# EAGLE design Sensor_board_2024 (EAGLE 9.6.2)
CHECKED: 02/25/2025; COMPANY: CDOSR; DATE: 02/25/2024; DESIGNER: CDOSR; DRAWN: 02/25/2024; DRGNO: 1; REV: 01; VERSION: v10; YEAR: 2024
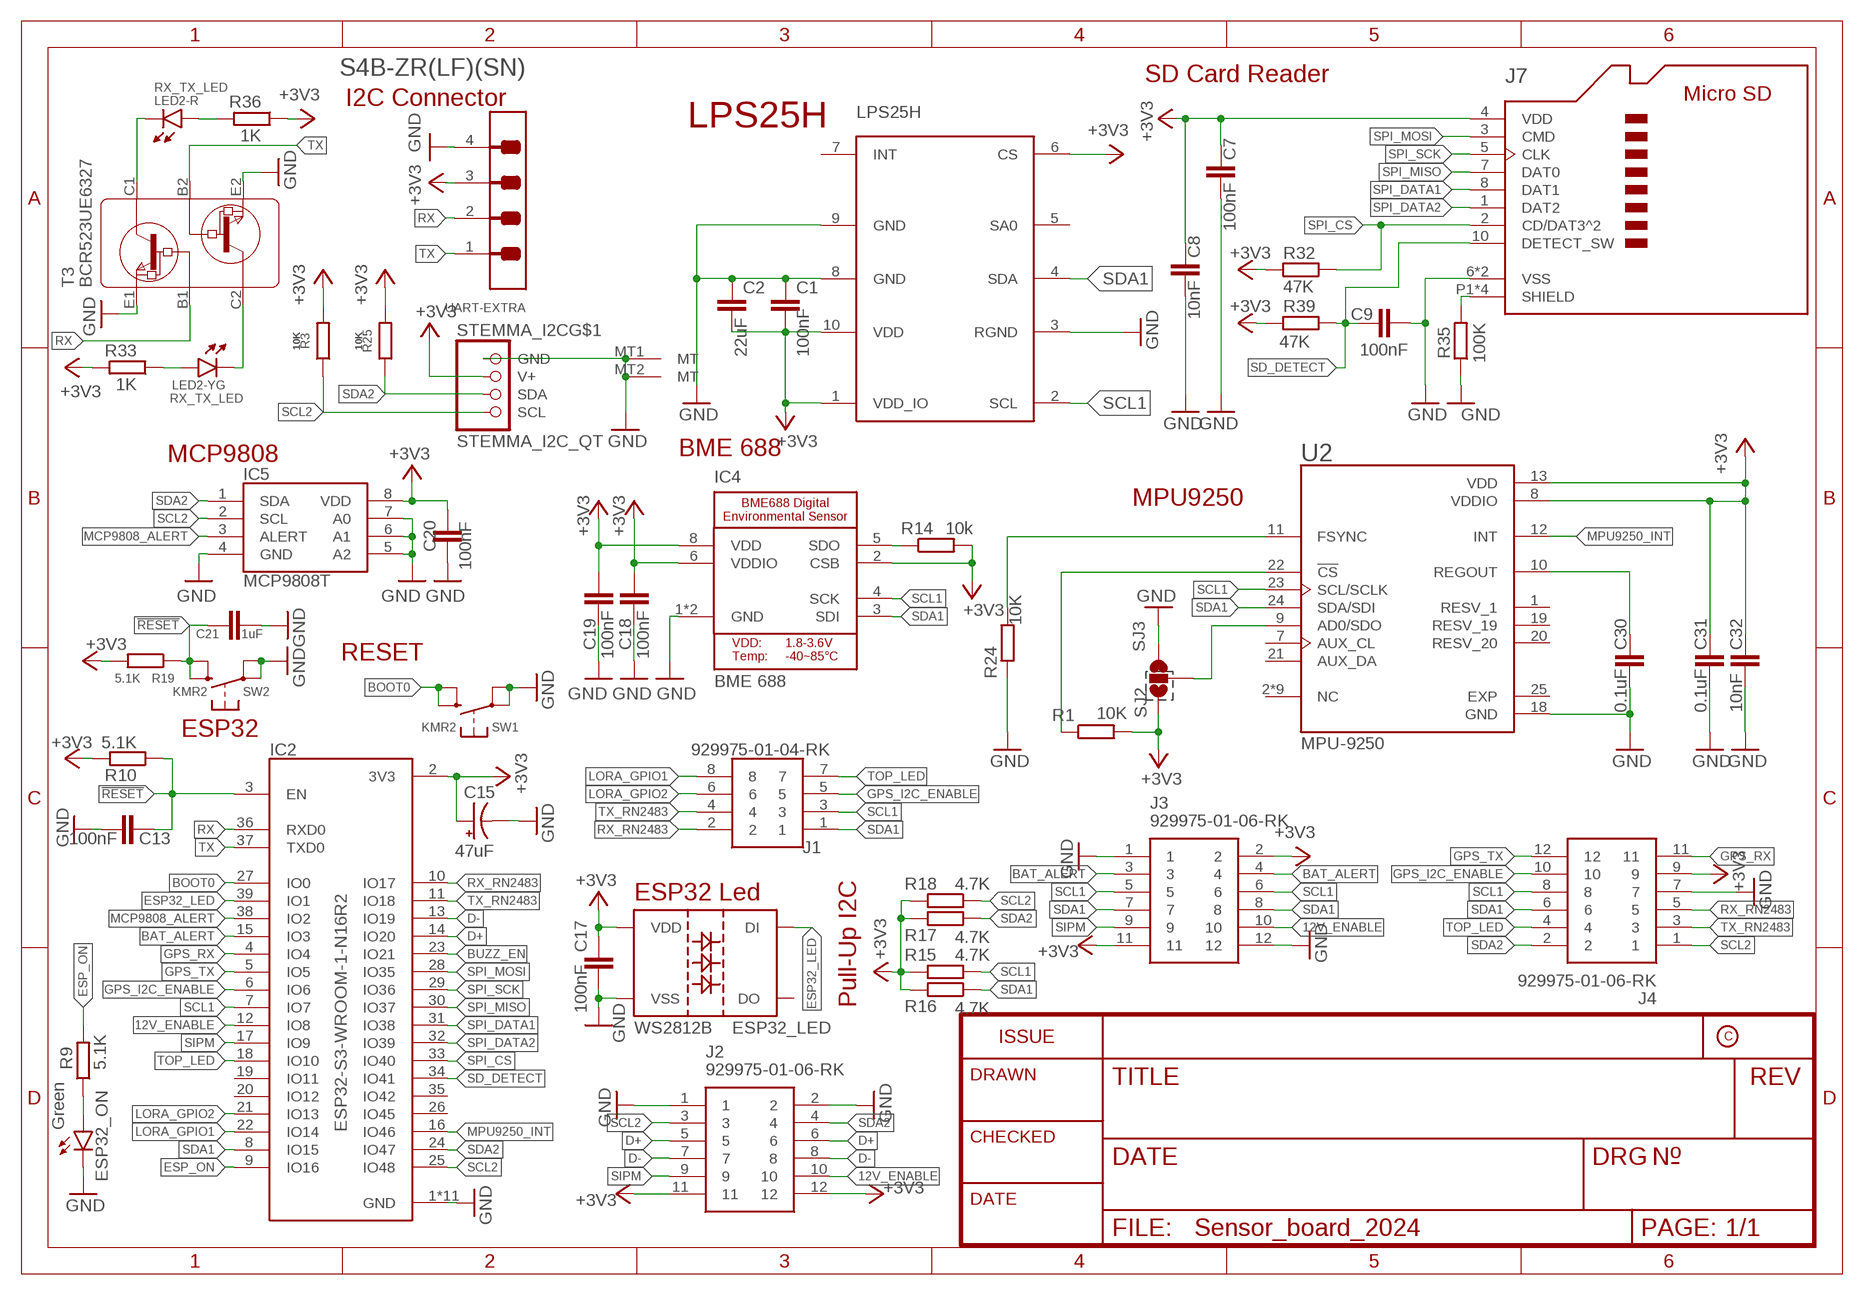
[diagram p0: schematic, sheet 1]

## Parts
C1  100nF  C-EUC0603  [C0603]
C2  22uF  C-EUC0603  [C0603]
C7  100nF  C-EUC0603  [C0603]
C8  10nF  C-EUC0603  [C0603]
C9  100nF  C-EUC0603  [C0603]
C13  100nF  C-EUC0603  [C0603]
C15  47uF  293D226X9025C2TE3  [CAPMP6032X250N]
C17  100nF  C-EUC0603  [C0603]
C18  100nF  C-EUC0603  [C0603]
C19  100nF  C-EUC0603  [C0603]
C20  100nF  C-EUC0603  [C0603]
C21  1uF  C-EUC0603  [C0603]
C30  0.1uF  0.1UF-25V(+80/-20%)(0603)  [0603-CAP]
C31  0.1uF  0.1UF-25V(+80/-20%)(0603)  [0603-CAP]
C32  10nF  0.1UF-25V(+80/-20%)(0603)  [0603-CAP]
ESP32_LED  WS2812B  [WS2812B]
ESP32_ON  Green  LEDCHIPLED_0805  [CHIPLED_0805]
IC2  ESP32-S3-WROOM-1-N16R2  [XCVR_ESP32-S3-WROOM-1-N16R2]
IC4  BME 688  BME_688_V1  [BME_688]
IC5  MCP9808T  MCP9808T-E_MS  [SOP65P490X110-8N]
J1  929975-01-04-RK  [RHDR8W76P254_2X4_1016X508X839P]
J2  929975-01-06-RK  [RHDR12W76P254_2X6_1524X508X839]
J3  929975-01-06-RK  [RHDR12W76P254_2X6_1524X508X839]
J4  929975-01-06-RK  [RHDR12W76P254_2X6_1524X508X839]
J7  503398-1892  [MOLEX_503398-1892]
LED2  RX_TX_LED  OSRG1206C1C  [3216(1206)-4]
LPS25H  LPS25H  [LPS25H]
R1  10K  R-EU_R0603  [R0603]
R3  10K  R-EU_R0603  [R0603]
R9  5.1K  R-EU_R0603  [R0603]
R10  5.1K  R-EU_R0603  [R0603]
R14  10k  R-EU_R0603  [R0603]
R15  4.7K  R-EU_R0603  [R0603]
R16  4.7K  R-EU_R0603  [R0603]
R17  4.7K  R-EU_R0603  [R0603]
R18  4.7K  R-EU_R0603  [R0603]
R19  5.1K  R-EU_R0603  [R0603]
R24  10K  R-EU_R0603  [R0603]
R25  10K  R-EU_R0603  [R0603]
R32  47K  R-EU_R0603  [R0603]
R33  1K  R-EU_R0603  [R0603]
R35  100K  R-EU_R0603  [R0603]
R36  1K  R-EU_R0603  [R0603]
R39  47K  R-EU_R0603  [R0603]
SJ2  SJ3  SPARKFUN_SOLDERJUMPER_2WAYS  [SPARKFUN_SJ_3]
STEMMA_I2C  STEMMA_I2C_QT  [JST_SH4]
SW1  KMR2  SWITCH_TACT_SMT4.6X2.8  [BTN_KMR2_4.6X2.8]
SW2  KMR2  SWITCH_TACT_SMT4.6X2.8  [BTN_KMR2_4.6X2.8]
T3  BCR523UE6327  NPNSOT23  [SOT-23]
U2  MPU-9250  [QFN40P300X300X105-25N]
UART-EXTRA  JST_S4B-ZR_LF  JST_S4B-ZR_LF_SNJST_S4B-ZR_LF_SN_0_0  [JST_S4B-ZR_LF_SN_0]

## Nets
12V_ENABLE: IC2.12(IO8) J2.10 J3.10
!RESET: C13.1 C21.1 IC2.3(EN) R10.1 R19.1 SW2.B'(S1) SW2.B(S)
+3V3: C1.2 C2.2 C7.1 C8.1 C15.1(+) C17.1 C18.2 C19.2 C20.2 C31.1 C32.1 ESP32_LED.1(VDD) IC2.2(3V3) IC4.2(CSB) IC4.6(VDDIO) IC4.8(VDD) IC5.8(VDD) J2.11 J2.12 J3.2 J3.11 J4.9 J7.4(VDD) LPS25H.1(VDD_IO) LPS25H.6(CS) LPS25H.10(VDD) R1.2 R3.2 R10.2 R14.2 R15.2 R16.2 R17.2 R18.2 R19.2 R25.2 R32.2 R33.2 R36.1 R39.2 SJ2.1 STEMMA_I2C.2(V+) U2.8(VDDIO) U2.13(VDD) UART-EXTRA.3
BAT_ALERT: IC2.15(IO3) J3.3 J3.4
BOOT0: IC2.27(IO0) SW1.B'(S1) SW1.B(S)
BUZZ_EN: IC2.23(IO21)
D+: IC2.14(IO20) J2.5 J2.6
D-: IC2.13(IO19) J2.7 J2.8
ESP32_LED: ESP32_LED.4(DI) IC2.39(IO1)
ESP_ON: IC2.9(IO16) R9.2
GND: C1.1 C2.1 C7.2 C8.2 C9.2 C13.2 C15.2(-) C17.2 C18.1 C19.1 C20.1 C21.2 C30.2 C31.2 C32.2 ESP32_LED.3(VSS) ESP32_ON.C IC2.1(GND) IC2.40(GND) IC2.41_1(GND) IC2.41_2(GND) IC2.41_3(GND) IC2.41_4(GND) IC2.41_5(GND) IC2.41_6(GND) IC2.41_7(GND) IC2.41_8(GND) IC2.41_9(GND) IC4.1(GND) IC4.7(GND) IC5.4(GND) IC5.5(A2) IC5.6(A1) IC5.7(A0) J2.1 J2.2 J3.1 J3.12 J4.7 J7.6(VSS) J7.9(VSS) LPS25H.3(RGND) LPS25H.8(GND) LPS25H.9(GND) R24.1 R35.1 SJ2.3 STEMMA_I2C.1(GND) STEMMA_I2C.MT1(MT) STEMMA_I2C.MT2(MT) SW1.A'(P1) SW1.A(P) SW2.A'(P1) SW2.A(P) T3.E1 T3.E2 U2.18(GND) UART-EXTRA.4
GPS_I2C_ENABLE: IC2.6(IO6) J1.5 J4.10
GPS_RX: IC2.4(IO4) J4.11
GPS_TX: IC2.5(IO5) J4.12
LORA_GPIO1: IC2.22(IO14) J1.8
LORA_GPIO2: IC2.21(IO13) J1.6
MCP9808_ALERT: IC2.38(IO2) IC5.3(ALERT)
MICROSD_SH2: J7.P1(SHIELD) J7.P2(SHIELD) J7.P3(SHIELD) J7.P4(SHIELD) R35.2
MPU9250_INT: IC2.16(IO46) U2.12(INT)
N$2: IC4.5(SDO) R14.1
N$3: R1.1 U2.22(!CS)
N$4: R24.2 U2.11(FSYNC)
N$6: ESP32_ON.A R9.1
N$7: SJ2.2 U2.9(AD0/SDO)
N$17: LED2.3(-YG:C) T3.C2
N$18: LED2.1(-R:C) T3.C1
N$22: LED2.2(-R:A) R36.2
N$23: LED2.4(-YG:A) R33.1
REGOUT: C30.1 U2.10(REGOUT)
RX: IC2.36(RXD0) T3.B1 UART-EXTRA.2
RX_RN2483: IC2.10(IO17) J1.2 J4.5
SCL1: IC2.7(IO7) IC4.4(SCK) J1.3 J3.5 J3.6 J4.8 LPS25H.2(SCL) R15.1 U2.23(SCL/SCLK)
SCL2: IC2.25(IO48) IC5.2(SCL) J2.3 J4.1 R3.1 R18.1 STEMMA_I2C.4(SCL)
SD_DETECT: C9.1 IC2.34(IO41) J7.10(DETECT_SW) R39.1
SDA1: IC2.8(IO15) IC4.3(SDI) J1.1 J3.7 J3.8 J4.6 LPS25H.4(SDA) R16.1 U2.24(SDA/SDI)
SDA2: IC2.24(IO47) IC5.1(SDA) J2.4 J4.2 R17.1 R25.1 STEMMA_I2C.3(SDA)
SIPM: IC2.17(IO9) J2.9 J3.9
SPI_CS: IC2.33(IO40) J7.2(CD/DAT3^2) R32.1
SPI_DATA1: IC2.31(IO38) J7.8(DAT1)
SPI_DATA2: IC2.32(IO39) J7.1(DAT2)
SPI_MISO: IC2.30(IO37) J7.7(DAT0)
SPI_MOSI: IC2.28(IO35) J7.3(CMD)
SPI_SCK: IC2.29(IO36) J7.5(CLK)
TOP_LED: IC2.18(IO10) J1.7 J4.4
TX: IC2.37(TXD0) T3.B2 UART-EXTRA.1
TX_RN2483: IC2.11(IO18) J1.4 J4.3
Unconnected: ESP32_LED.2(DO) IC2.19(IO11) IC2.20(IO12) IC2.26(IO45) IC2.35(IO42) LPS25H.5(SA0) LPS25H.7(INT) U2.2(NC) U2.3(NC) U2.4(NC) U2.5(NC) U2.6(NC) U2.7(AUX_CL) U2.14(NC) U2.15(NC) U2.16(NC) U2.17(NC) U2.19(RESV_19) U2.21(AUX_DA) U2.25(EXP)

## Notes on the sheet
- I2C Connector | SD Card Reader
- LPS25H
- MCP9808 | BME 688
- MPU9250
- RESET
- ESP32
- ESP32 Led
- Pull-Up I2C

## Power pins joined to a net without a drawn wire
RESV_1: U2.1(RESV_1)
RESV_20: U2.20(RESV_20)

## Library data of the parts
C1 C2 C7-C9 C13 C17-C21 = rcl:C-EU: CAPACITOR, European symbol; SPICEPREFIX: C
C15 = 293D226X9025C2TE3:293D226X9025C2TE3: Surface Mount Tantalum Capacitor, TANTAMOUNTr, 293D Series, 22 F, 10%, 25 V, 2412 Check prices <https://pricing.snapeda.com/parts/293D226X9025C2TE3/Vishay/view-part?ref=eda>; AVAILABILITY: Warning; DESCRIPTION: Surface Mount Tantalum Capacitor, TANTAMOUNTr, 293D Series, 22 F, 10%, 25 V, 2412 [6032 Metric]; MF: Vishay; MP: 293D226X9025C2TE3; PACKAGE: None; PRICE: None; PURCHASE-URL: https://pricing.snapeda.com/search/part/293D226X9025C2TE3/?ref=eda
C30 C31 = SparkFun-Capacitors:0.1UF-25V(+80/-20%)(0603): CAP-00810 Ceramic Standard decoupling cap; PROD_ID: CAP-00810
C32 = SparkFun-Capacitors:0.1UF-25V(+80/-20%)(0603): CAP-00810 Ceramic Standard decoupling cap; PROD_ID: CAP-00810; VALUE: 0.1uF
ESP32_LED = WS2812:WS2812B
ESP32_ON = led:LED: LED OSRAM: - CHIPLED LG R971, LG N971, LY N971, LG Q971, LY Q971, LO R971, LY R971 LH N974, LH R974 LS Q976, LO Q976, LY Q976 LO Q996 - Hyper CHIPLED LW Q18S LB Q993, LB Q99A, LB R99A - SideLED LS A670, LO A670, LY A670, LG A670, LP A670 LB A673, LV A673, LT A673, LW A673 LH A674 LY A675 LS A676, LA A676, LO A676, LY A676, LW A676 LS A679, LY A679, LG A679 - Hyper Micro SIDELED® LS Y876, LA Y876, LO Y876, LY Y876 LT Y87S - SmartLED LW L88C, LW L88S LB L89C, LB L89S, LG L890 LS L89K, LO L89K, LY L89K LS L896, LA L896, LO L896, LY L896 - TOPLED LS T670, LO T670, LY T670, LG T670, LP T670 LSG T670, LSP T670, LSY T670, LOP T670, LYG T670 LG T671, LOG T671, LSG T671 LB T673, LV T673, LT T673, LW T673 LH T674 LS T676, LA T676, LO T676, LY T676, LB T676, LH T676, LSB T676, LW T676 LB T67C, LV T67C, LT T67C, LS T67K, LO T67K, LY T67K, LW E67C LS E67B, LA E67B, LO E67B, LY E67B, LB E67C, LV E67C, LT E67C LW T67C LS T679, LY T679, LG T679 LS T770, LO T770, LY T770, LG T770, LP T770 LB T773, LV T773, LT T773, LW T773 LH T774 LS E675, LA E675, LY E675, LS T675 LS T776, LA T776, LO T776, LY T776, LB T776 LHGB T686 LT T68C, LB T68C - Hyper Mini TOPLED® LB M676 - Mini TOPLED Santana® LG M470 LS M47K, LO M47K, LY M47K Source: http://www.osram.convergy.de LUXEON: - LUMILED® LXK2-PW12-R00, LXK2-PW12-S00, LXK2-PW14-U00, LXK2-PW14-V00 LXK2-PM12-R00, LXK2-PM12-S00, LXK2-PM14-U00 LXK2-PE12-Q00, LXK2-PE12-R00, LXK2-PE12-S00, LXK2-PE14-T00, LXK2-PE14-U00 LXK2-PB12-K00, LXK2-PB12-L00, LXK2-PB12-M00, LXK2-PB14-N00, LXK2-PB14-P00, LXK2-PB14-Q00 LXK2-PR12-L00, LXK2-PR12-M00, LXK2-PR14-Q00, LXK2-PR14-R00 LXK2-PD12-Q00, LXK2-PD12-R00, LXK2-PD12-S00 LXK2-PH12-R00, LXK2-PH12-S00 LXK2-PL12-P00, LXK2-PL12-Q00, LXK2-PL12-R00 Source: www.luxeon.com KINGBRIGHT: KA-3528ASYC Source: www.kingbright.com
IC2 = ESP32-S3-WROOM-1-N16R2_v2a:ESP32-S3-WROOM-1-N16R2: Check availability <https://pricing.snapeda.com/parts/ESP32-S3-WROOM-1-N16R2/Espressif%20Systems/view-part?ref=eda>; AVAILABILITY: In Stock; DESCRIPTION: Bluetooth, WiFi 802.11b/g/n, Bluetooth v5.0 Transceiver Module 2.4GHz PCB Trace Surface Mount; MF: Espressif Systems; MP: ESP32-S3-WROOM-1-N16R2; PACKAGE: None; PRICE: None; PURCHASE-URL: https://pricing.snapeda.com/search?q=ESP32-S3-WROOM-1-N16R2&ref=eda; SPICEPREFIX: X
IC4 = Adafruit BME688:BME_688
IC5 = MCP9808T-E_MS:MCP9808T-E_MS: Microchip MCP9808T-E/MS, Temperature Converter -40 +125 C +/-1C Serial-I2C, SMBus, 8-Pin MSOP Source: Datasheet <https://ww1.microchip.com/downloads/en/DeviceDoc/25095A.pdf>; DESCRIPTION: Microchip MCP9808T-E/MS, Temperature Converter -40 +125 C +/-1C Serial-I2C, SMBus, 8-Pin MSOP; HEIGHT: 1.1mm; MANUFACTURER_NAME: Microchip; MANUFACTURER_PART_NUMBER: MCP9808T-E/MS; MOUSER_PART_NUMBER: 579-MCP9808T-E/MS; MOUSER_PRICE-STOCK: https://www.mouser.co.uk/ProductDetail/Microchip-Technology-Atmel/MCP9808T-E-MS?qs=fgHA1UgJI8BYolGts7svKQ%3D%3D
J1 = 929975-01-04-RK:929975-01-04-RK: 8 Position Receptacle Connector 0.100" (2.54mm) Through Hole Tin Source: Datasheet <https://componentsearchengine.com/Datasheets/1/929975-01-04-RK.pdf>; DESCRIPTION: 8 Position Receptacle Connector 0.100" (2.54mm) Through Hole Tin; HEIGHT: 8.387mm; MANUFACTURER_NAME: 3M; MANUFACTURER_PART_NUMBER: 929975-01-04-RK; MOUSER_PART_NUMBER: 517-929975-01-04-RK; MOUSER_PRICE-STOCK: https://www.mouser.com/Search/Refine.aspx?Keyword=517-929975-01-04-RK
J2-J4 = 929975-01-06-RK:929975-01-06-RK: Headers & Wire Housings 2ROW BDMNT SCKT SN STRT SLDR TAIL Source: Datasheet <https://multimedia.3m.com/mws/media/22500O/3mtm-boardmount-skt-100-100x-100strt-sldr-tails-ts0815.pdf>; DESCRIPTION: Headers & Wire Housings 2ROW BDMNT SCKT SN STRT SLDR TAIL; HEIGHT: 8.387mm; MANUFACTURER_NAME: 3M; MANUFACTURER_PART_NUMBER: 929975-01-06-RK; MOUSER_PART_NUMBER: 517-929975-01-06-RK; MOUSER_PRICE-STOCK: https://www.mouser.co.uk/ProductDetail/3M-Electronic-Solutions-Division/929975-01-06-RK?qs=4V84emjyG36joYvi6g1rwA%3D%3D
J7 = 503398-1892:503398-1892: 1.10mm Pitch microSD Memory Card Connector, Normal Mount Surface Mount, Push-Push Type, 1.28mm Height Check availability <https://pricing.snapeda.com/parts/5033981892/Molex/view-part?ref=eda>; AVAILABILITY: In Stock; DESCRIPTION: 9 (8 + 1) Position Card Connector Secure Digital - microSD™ Surface Mount, Right Angle Gold; MF: Molex; MP: 5033981892; PACKAGE: None; PRICE: None; PURCHASE-URL: https://pricing.snapeda.com/search/part/5033981892/?ref=eda
LED2 = OSRG1206C1C:OSRG1206C1C: Bi-color LED Check availability <https://pricing.snapeda.com/parts/OSRG1206C1C/OptoSupply/view-part?ref=eda>; AVAILABILITY: Not in stock; CHECK_PRICES: https://www.snapeda.com/parts/OSRG1206C1C/OptoSupply/view-part/?ref=eda; DESCRIPTION: LED; SMD; 1206; red/green; 3.2x2.7mm; 120°; Variant: bicolour; MF: OptoSupply; MP: OSRG1206C1C; PACKAGE: None; PRICE: None; SNAPEDA_LINK: https://www.snapeda.com/parts/OSRG1206C1C/OptoSupply/view-part/?ref=snap
LPS25H = LPS25H:LPS25H: ST-Micro Piezoresistive pressure sensor; AVAILABILITY: Unavailable; DESCRIPTION: LPS25HB - Pressure Sensor Evaluation Board; MF: STMicroelectronics; MP: LPS25H; PACKAGE: VFLGA-10 STMicroelectronics; PRICE: None
R1 R3 R9 R10 R14-R19 R24 R25 R32 R33 R35 R36 R39 = rcl:R-EU_: RESISTOR, European symbol; SPICEPREFIX: R
SJ2 = SolderJumps:SPARKFUN_SOLDERJUMPER_2WAY: Solder Jumper 2 way solder jumper
STEMMA_I2C = microbuilder:STEMMA_I2C
SW1 SW2 = microbuilder:SWITCH_TACT_SMT: SMT Tact Switches 6x6mm - Digikey: P12940SCT-ND KMR2 (4.6x2.8mm) - Digikey: 401-1426-1-ND EVQ-PQHB55 - Light Touch, 160GF (4.5x4.5mm) - Digikey: P8090SCT-ND KMT0 - KMT021 NGJ LHS (etc.) IP68/Waterproof - Digikey: CKN10289CT-ND
T3 = BCR523UE6327:NPNSOT23: NPN TRANSISTOR; MPN: DSS20201L-7; OC_FARNELL: 1710688; OC_NEWARK: 25R4555
U2 = MPU-9250:MPU-9250: Check availability <https://pricing.snapeda.com/parts/MPU-9250/TDK%20InvenSense/view-part?ref=eda>; AVAILABILITY: In Stock; CHECK_PRICES: https://www.snapeda.com/parts/MPU-9250/TDK+InvenSense/view-part/?ref=eda; DESCRIPTION: MPU-9250 series Accelerometer, Gyroscope, Humidity, Magnetometer, Pressure, Temperature Sensor Evaluation Board; MF: TDK InvenSense; MP: MPU-9250; PACKAGE: TFQFN-24 TDK InvenSense; PRICE: None; SNAPEDA_LINK: https://www.snapeda.com/parts/MPU-9250/TDK+InvenSense/view-part/?ref=snap
UART-EXTRA = jumpers:JST_S4B-ZR_LF_SN: Connector Header Through Hole, Right Angle 4 position 0.059" (1.50mm); AUTOMOTIVE: No; CENTROID_NOT_SPECIFIED: No; CONN_GENDER: Male; CONN_ORIENTATION: Right Angle; CONTACT_MATERIAL: Tin; CURRENT_RATING: 1A; DATASHEET: http://www.jst-mfg.com/product/pdf/eng/eZH.pdf; DEVICE_CLASS_L1: Connectors; DEVICE_CLASS_L2: Headers and Wire Housings; DEVICE_CLASS_L3: unset; DIGIKEY_DESCRIPTION: CONN HEADER R/A 4POS 1.5MM; DIGIKEY_PART_NUMBER: 455-1671-ND; FOOTPRINT_VARIANT_NAME_0: Recommended_Land_Pattern; HEIGHT: 3.7mm; LEAD_FREE: Yes; MF: JST; MFG_PACKAGE_IDENT: S4B-ZR(LF)(SN); MFG_PACKAGE_IDENT_DATE: 0; MFG_PACKAGE_IDENT_REV: 0; MPN: S4B-ZR(LF)(SN); NUMBER_OF_CONTACTS: 4; NUMBER_OF_ROWS: 1; PACKAGE: HDR4; PITCH: 1.5mm; PREFIX: J; ROHS: Yes; TEMPERATURE_RANGE_HIGH: +85°C; TEMPERATURE_RANGE_LOW: -25°C; VERIFICATION_VERSION: 0.0.0.3; VOLTAGE_RATING: 50V

## Net classes
0 Default: width 0.203 mm
1 highpower: width 0.305 mm, drill 0.483 mm
2 lowpower: width 0.254 mm, drill 0.483 mm

## Board
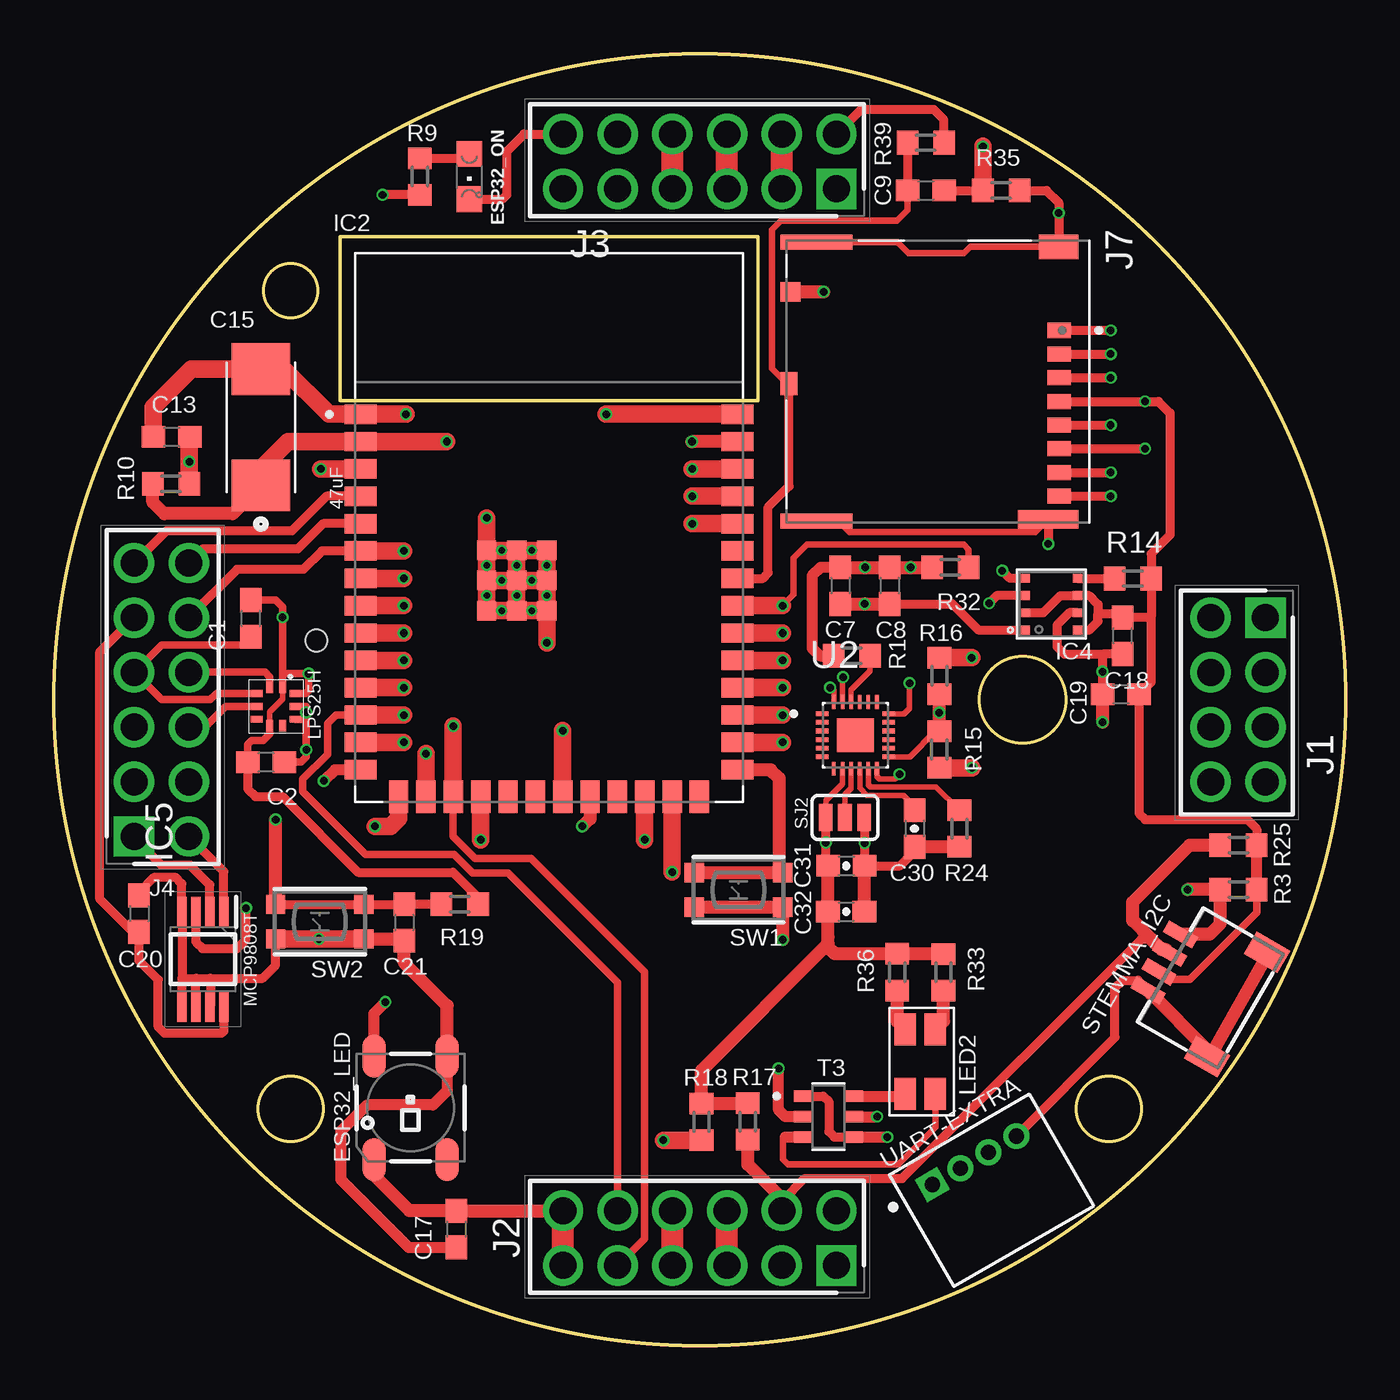
[diagram p1: board, top side]
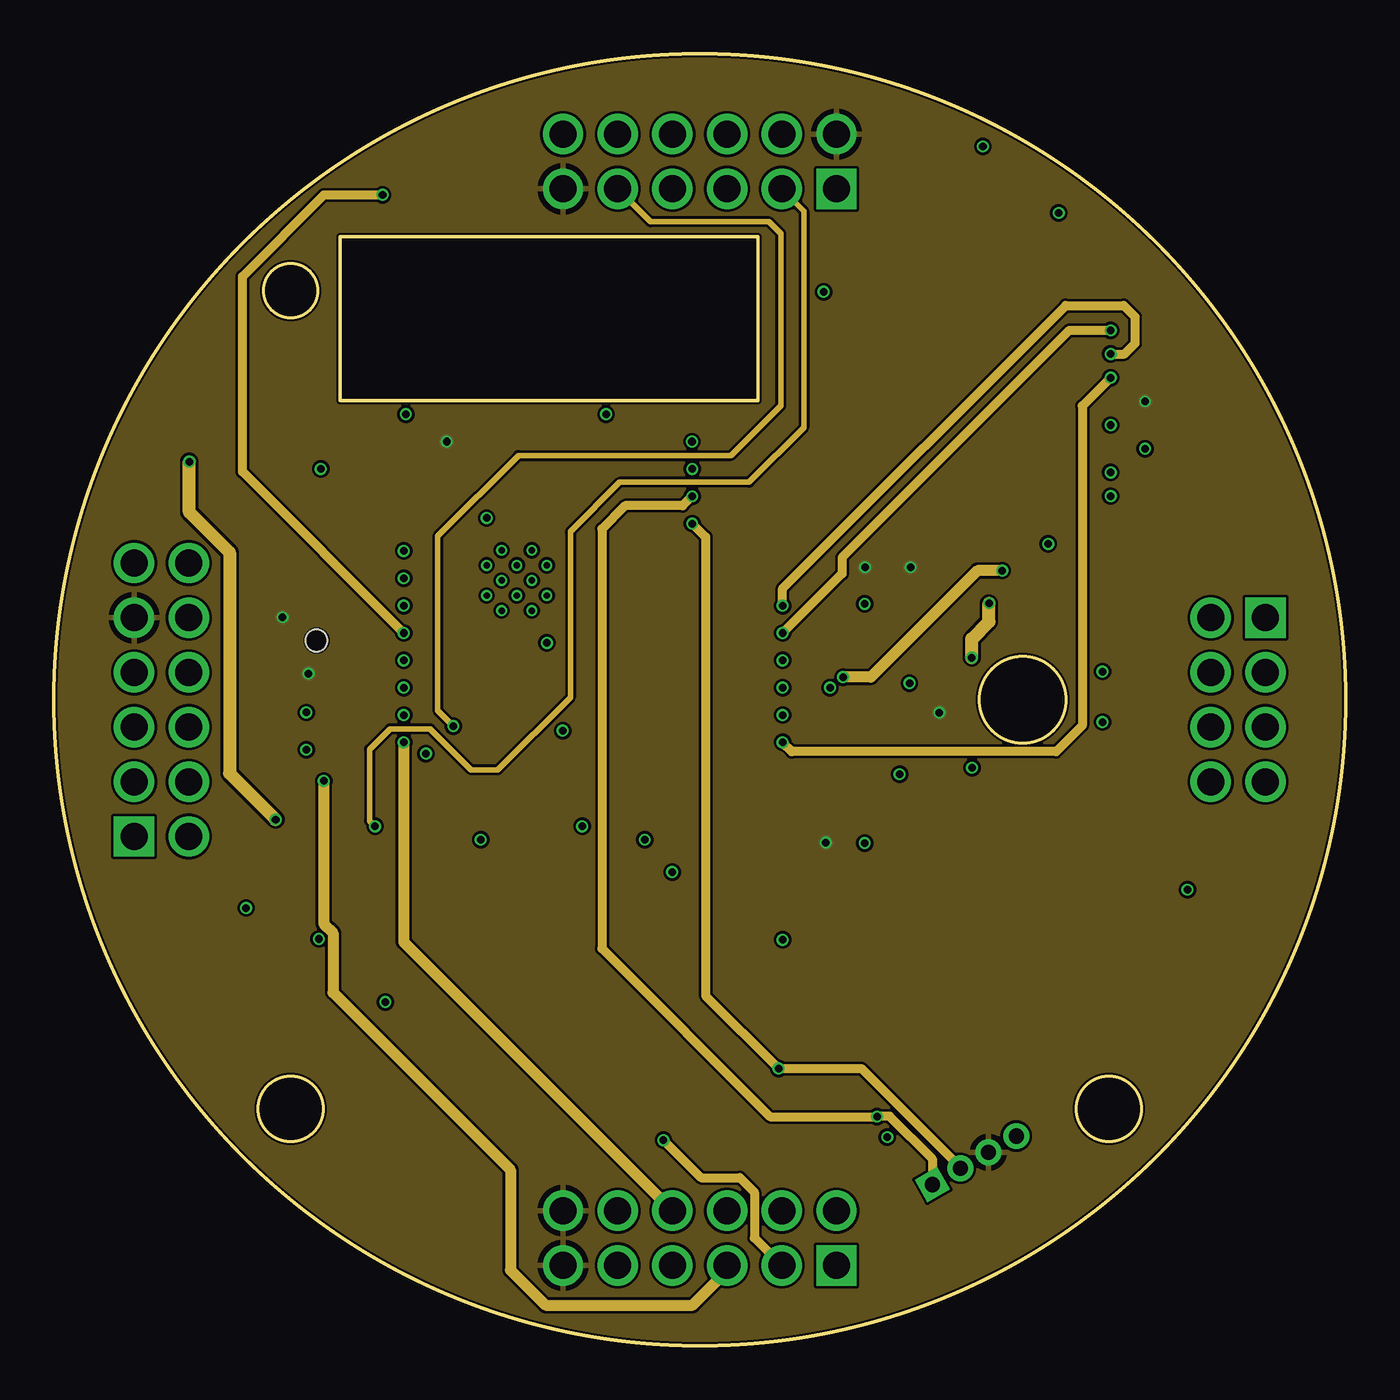
[diagram p2: board, inner layer Route2]
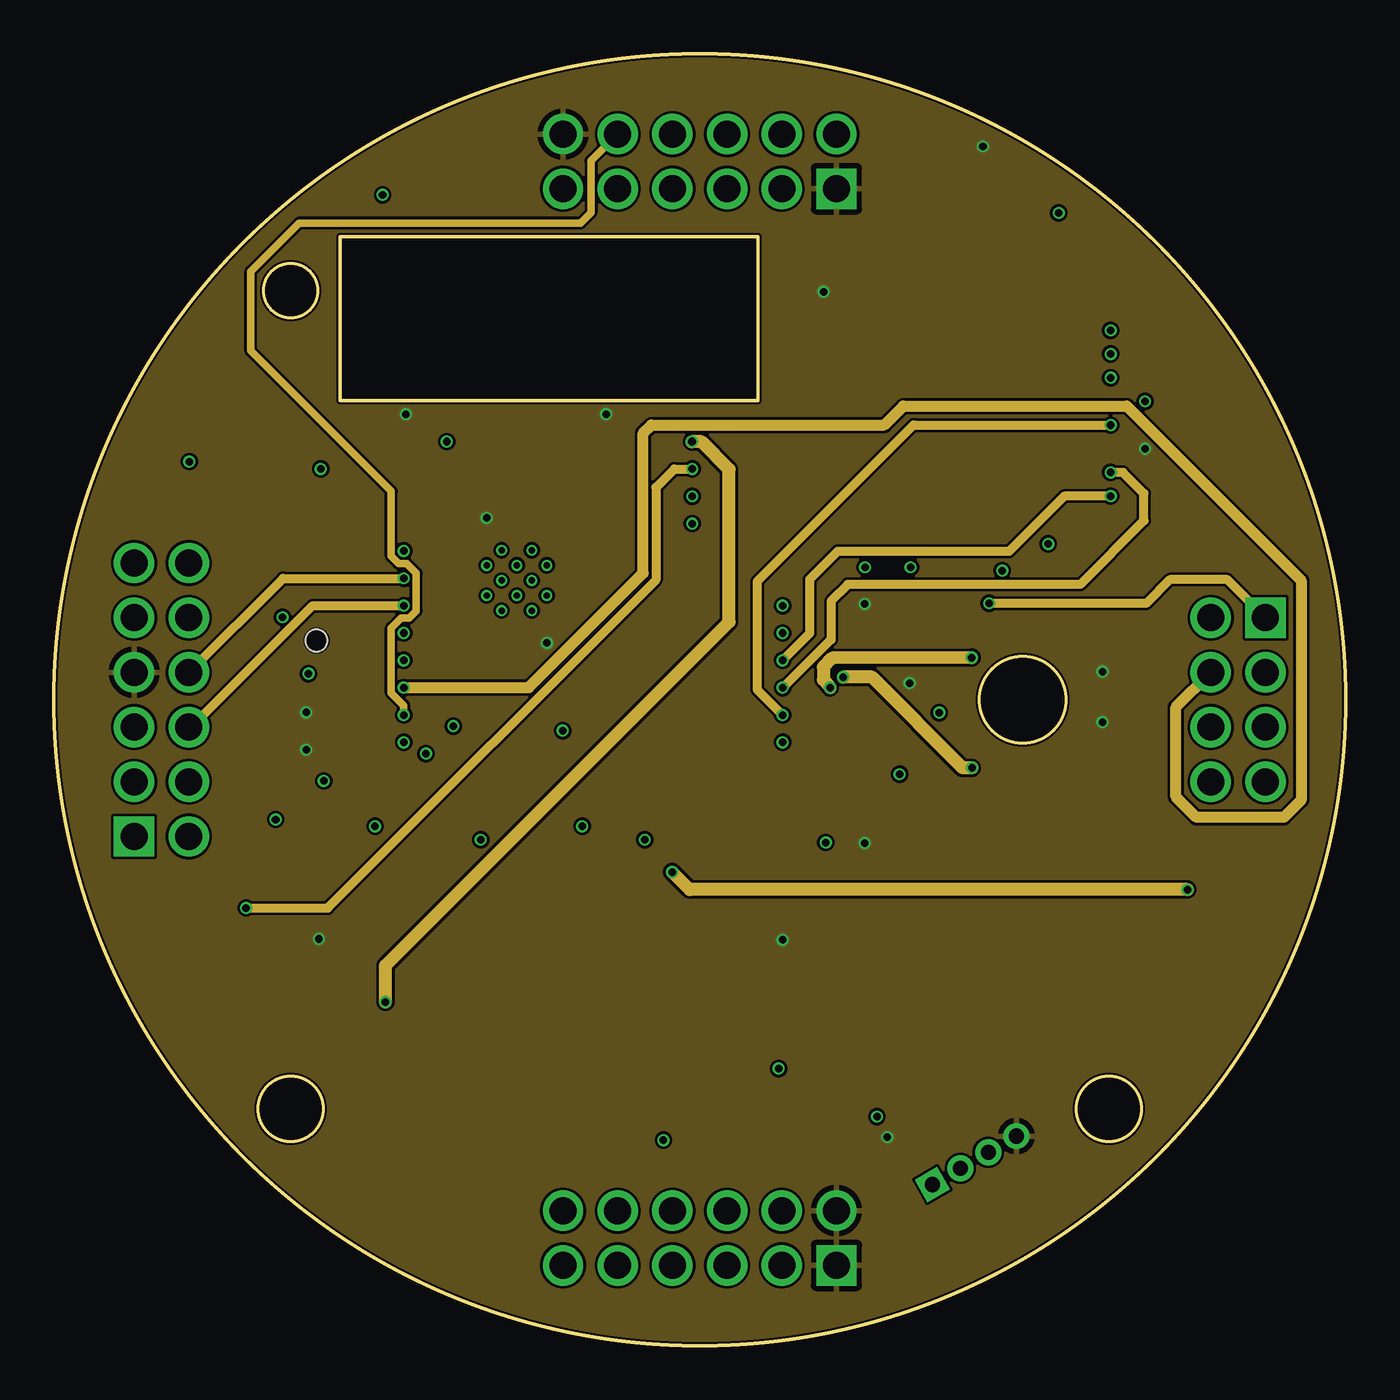
[diagram p3: board, inner layer Route15]
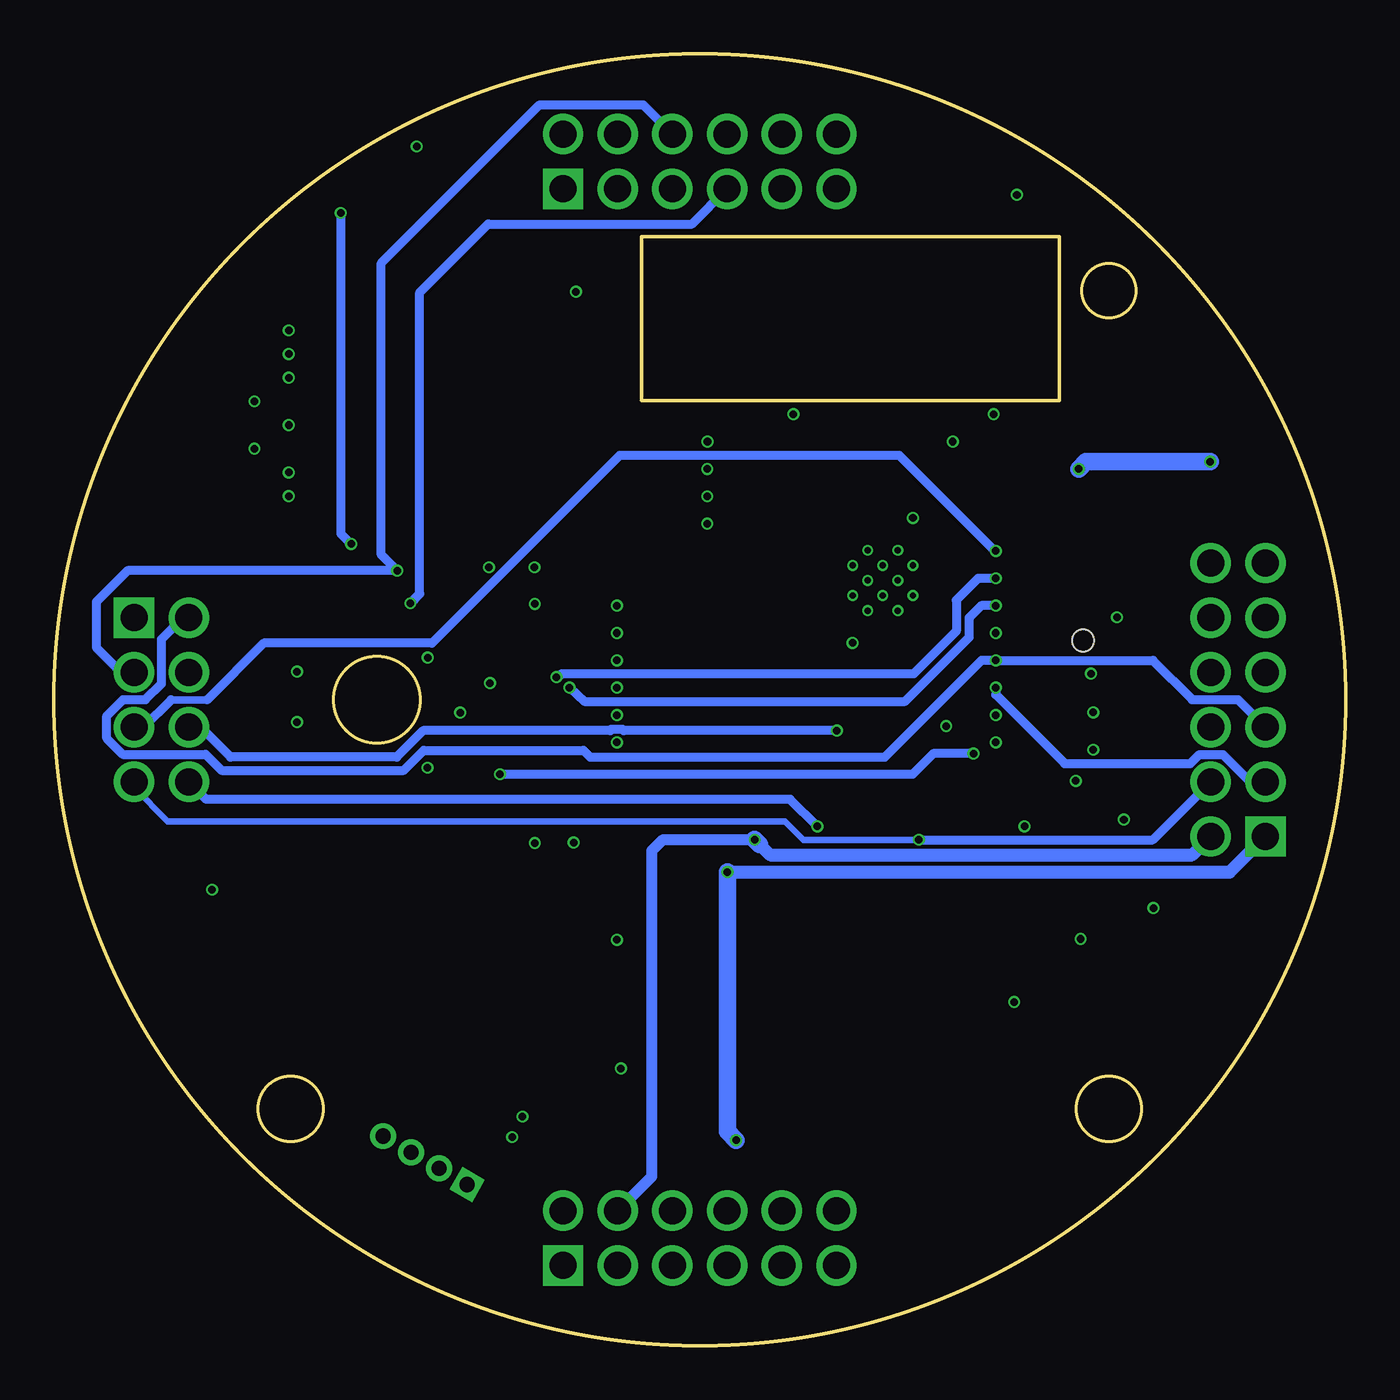
[diagram p4: board, bottom side, seen from below]

Size 60 x 60 mm. Coordinates in mm from the lower left corner, seen from the top.
Outline: 13.3,51.5 32.7,51.5 32.7,43.9 13.3,43.9 13.3,51.5
Outline: circle at 30,30 radius 30
Outline: circle at 11,49 radius 1.25
Outline: circle at 11,11 radius 1.5
Outline: circle at 49,11 radius 1.5
Outline: circle at 45,30 radius 2
Copper layers (1*2*15*16): Top 0.035559375mm / dielectric 0.17018125mm / Route2 0.01778125mm / dielectric 47mil / Route15 0.01778125mm / dielectric 0.17018125mm / Bottom 0.035559375mm
Design rules "jlcpcb-4-layer": minimum track width 5mil, minimum drill 0.2mm, track to track 0.126490625mm, track to pad 0.126490625mm, pad to pad 0.126490625mm, via to via 0.126490625mm, smd to smd 0mil, copper to edge 0.1mm, drill to drill 5mil, minimum pad ring 4mil, minimum via ring 4mil, stop-mask expansion 3mil, vias tented up to drill 100mil, thermal gap 10mil
Holes 1 mm at 12.2,32.75

### Footprints (pad centres in the part's own frame; a part is rotated, then mirrored left to right if it is on the bottom)
C0603 = smd 1.1 x 1: 1 -0.85,0; 2 0.85,0
CAPMP6032X250N = smd 2.4 x 2.7: 1 -2.7,0; 2 2.7,0
0603-CAP = smd 1.1 x 1: 1 -0.85,0; 2 0.85,0
WS2812B = smd 2 x 1.1: 1 -2.4,1.7; 2 -2.4,-1.7; 3 2.4,-1.7; 4 2.4,1.7
CHIPLED_0805 = smd 1.2 x 1.2: A 0,-1.05; C 0,1.05
XCVR_ESP32-S3-WROOM-1-N16R2 = smd 1.5 x 0.9: 1 -8.75,5.26; 2 -8.75,3.99; 3 -8.75,2.72; 4 -8.75,1.45; 5 -8.75,0.18; 6 -8.75,-1.09; 7 -8.75,-2.36; 8 -8.75,-3.63; 9 -8.75,-4.9; 10 -8.75,-6.17; 11 -8.75,-7.44; 12 -8.75,-8.71; 13 -8.75,-9.98; 14 -8.75,-11.25; 27 8.75,-11.25; 28 8.75,-9.98; 29 8.75,-8.71; 30 8.75,-7.44; 31 8.75,-6.17; 32 8.75,-4.9; 33 8.75,-3.63; 34 8.75,-2.36; 35 8.75,-1.09; 36 8.75,0.18; 37 8.75,1.45; 38 8.75,2.72; 39 8.75,3.99; 40 8.75,5.26 | smd 0.9 x 1.5: 15 -6.985,-12.5; 16 -5.715,-12.5; 17 -4.445,-12.5; 18 -3.175,-12.5; 19 -1.905,-12.5; 20 -0.635,-12.5; 21 0.635,-12.5; 22 1.905,-12.5; 23 3.175,-12.5; 24 4.445,-12.5; 25 5.715,-12.5; 26 6.985,-12.5 | smd 0.9 x 0.9: 41_1 -1.5,-2.46; 41_2 -2.9,-2.46; 41_3 -0.1,-2.46; 41_4 -2.9,-3.86; 41_5 -1.5,-3.86; 41_6 -0.1,-3.86; 41_7 -2.9,-1.06; 41_8 -1.5,-1.06; 41_9 -0.1,-1.06 | drill 0.3 pad 0.45: 41_10 -1.5,-1.76; 41_11 -2.9,-1.76; 41_12 -0.1,-1.76; 41_13 -2.9,-3.16; 41_14 -1.5,-3.16; 41_15 -0.1,-3.16; 41_16 -2.2,-1.06; 41_17 -0.8,-1.06; 41_18 -2.2,-2.46; 41_19 -0.8,-2.46; 41_20 -2.2,-3.86; 41_21 -0.8,-3.86
BME_688 = smd 0.4 x 0.4: 1 1.2,1.2; 2 1.2,0.4; 3 1.2,-0.4; 4 1.2,-1.2; 5 -1.2,-1.2; 6 -1.2,-0.4; 7 -1.2,0.4; 8 -1.2,1.2
SOP65P490X110-8N = smd 1.4 x 0.45: 1 -2.2,0.975; 2 -2.2,0.325; 3 -2.2,-0.325; 4 -2.2,-0.975; 5 2.2,-0.975; 6 2.2,-0.325; 7 2.2,0.325; 8 2.2,0.975
RHDR8W76P254_2X4_1016X508X839P = drill 1.25 pad 1.875 square: 1 3.81,-1.27 | drill 1.25 pad 1.875: 2 3.81,1.27; 3 1.27,-1.27; 4 1.27,1.27; 5 -1.27,-1.27; 6 -1.27,1.27; 7 -3.81,-1.27; 8 -3.81,1.27
RHDR12W76P254_2X6_1524X508X839 = drill 1.25 pad 1.875 square: 1 6.35,-1.27 | drill 1.25 pad 1.875: 2 6.35,1.27; 3 3.81,-1.27; 4 3.81,1.27; 5 1.27,-1.27; 6 1.27,1.27; 7 -1.27,-1.27; 8 -1.27,1.27; 9 -3.81,-1.27; 10 -3.81,1.27; 11 -6.35,-1.27; 12 -6.35,1.27
MOLEX_503398-1892 = smd 0.7 x 1.1: 1 -2.38,5.625; 2 -1.28,5.625; 3 -0.18,5.625; 4 0.92,5.625; 5 2.02,5.625; 6 3.12,5.625; 7 4.22,5.625; 8 5.32,5.625 | smd 0.9 x 0.93: 9 -4.17,-6.84 | smd 1.05 x 0.78: 10 0.095,-6.915 | smd 1.14 x 1.83: P1 -6.26,5.61 | smd 0.86 x 2.8: P2 6.4,5.125 | smd 0.7 x 3.33: P3 -6.48,-5.64; P4 6.48,-5.64
3216(1206)-4 = smd 1.5 x 1: 1 -1.5,0.775; 2 1.5,0.775; 3 -1.5,-0.625; 4 1.5,-0.625
LPS25H = smd 0.32 x 0.55: 1 -0.3,-0.9; 2 0.3,-0.9; 6 0.3,0.9; 7 -0.3,0.9 | smd 0.55 x 0.32: 3 0.9,-0.6; 4 0.9,0; 5 0.9,0.6; 8 -0.9,0.6; 9 -0.9,0; 10 -0.9,-0.6
R0603 = smd 1 x 1.1: 1 -0.85,0; 2 0.85,0
SPARKFUN_SJ_3 = smd 0.635 x 1.27: 1 -0.889,0; 2 0,0; 3 0.889,0
JST_SH4 = smd 0.6 x 1.55: 1 -1.5,2.514; 2 -0.5,2.514; 3 0.5,2.514; 4 1.5,2.514 | smd 1.2 x 1.8: MT1 -2.8,-1.386; MT2 2.8,-1.386
BTN_KMR2_4.6X2.8 = smd 0.9 x 0.9: A 2.05,0.8; A' -2.05,0.8; B 2.05,-0.8; B' -2.05,-0.8
SOT-23 = smd 0.8 x 0.55: B1 1.2,0; B2 -1.2,0; C1 -1.2,-0.95; C2 1.2,0.95; E1 1.2,-0.95; E2 -1.2,0.95
QFN40P300X300X105-25N = smd 0.64 x 0.22: 1 -1.545,1; 2 -1.545,0.6; 3 -1.545,0.2; 4 -1.545,-0.2; 5 -1.545,-0.6; 6 -1.545,-1; 13 1.545,-1; 14 1.545,-0.6; 15 1.545,-0.2; 16 1.545,0.2; 17 1.545,0.6; 18 1.545,1 | smd 0.22 x 0.64: 7 -1,-1.545; 8 -0.6,-1.545; 9 -0.2,-1.545; 10 0.2,-1.545; 11 0.6,-1.545; 12 1,-1.545; 19 1,1.545; 20 0.6,1.545; 21 0.2,1.545; 22 -0.2,1.545; 23 -0.6,1.545; 24 -1,1.545 | smd 1.7 x 1.54: 25 0,0
JST_S4B-ZR_LF_SN_0 = drill 0.7 pad 1.2 square: 1 -2.25,1.6 | drill 0.7 pad 1.2: 2 -0.75,1.6; 3 0.75,1.6; 4 2.25,1.6

### Placement (x,y rotation side)
C1  9.16,33.78 90 top
C2  9.86,27.1 180 top
C7  36.53,35.3 270 top
C8  38.82,35.3 270 top
C9  40.5,53.65 0 top
C13  5.47,42.2 180 top
C15  9.62,42.66 90 top
C17  18.69,5.42 270 top
C18  49.65,32.97 90 top
C19  49.55,30.26 0 top
C20  3.96,20.07 270 top
C21  16.28,19.66 270 top
C30  39.97,24.02 270 top
C31  36.81,22.28 0 top
C32  36.8,20.15 0 top
ESP32_LED  16.57,11.05 90 top
ESP32_ON  19.3,54.3 180 top
IC2  23,38 0 top
IC4  46.34,34.44 180 top
IC5  6.92,17.95 270 top
J1  55,30 90 top
J2  30,5 0 top
J3  30,55 0 top
J4  5,30 270 top
J7  41.06,44.78 270 top
LED2  40.31,13.19 90 top
LPS25H  10.32,29.69 180 top
R1  37.06,32.04 180 top
R3  55.02,21.18 0 top
R9  17,54.3 270 top
R10  5.44,40.03 180 top
R14  50.11,35.63 0 top
R15  41.13,27.69 90 top
R16  41.13,31.11 270 top
R17  32.23,10.41 90 top
R18  30.08,10.39 90 top
R19  18.85,20.51 0 top
R24  42.06,24.02 90 top
R25  55.02,23.25 0 top
R32  41.64,36.15 180 top
R33  41.32,17.34 90 top
R35  44,53.65 0 top
R36  39.17,17.35 270 top
R39  40.5,55.87 0 top
SJ2  36.75,24.53 0 top
STEMMA_I2C  53.75,16.54 60 top
SW1  31.8,21.17 180 top
SW2  12.35,19.69 180 top
T3  35.97,10.64 180 top
U2  37.23,28.35 0 top
UART-EXTRA  43.55,7.22 30 top

### Tracks (layer width: path | path; a pad name or v marks a point on that pad's centre or on a via)
12V_ENABLE  (via drill 0.35)
  Top 0.35: IC2.12 13.1,29.29 12.71,28.9 12.71,27.46 11.56,26.31 11.56,25.74 14.49,22.81 18.6,22.81 19.45,21.96 21.1,21.96 26.19,16.87 J2.10
  Top 0.813: IC2.12 v16.25,29.29
  Route15 0.35: v16.25,29.29 16.25,29.74 15.67,30.32 15.67,33.34 16.12,33.79 16.49,33.79 16.83,34.13 16.83,35.88 16.38,36.33 16.01,36.33 15.67,36.67 15.67,39.69 9.15,46.21 9.15,49.89 11.4,52.14 24.47,52.14 24.95,52.62 24.95,55.03 J3.10
!RESET  (via drill 0.35)
  Top 0.406: SW2.B SW2.B' 16.26,20.49 C21.1 R19.1
  Top 0.61: SW2.B v10.3,24.44
  Top 0.813: IC2.3 v12.4,40.72 | R10.1 v6.29,41.06 6.29,42.17 C13.1
  Route2 0.61: v10.3,24.44 8.16,26.58 8.16,36.84 6.29,38.71 v6.29,41.06
  Bottom 0.813: v6.29,41.06 12.06,41.06 v12.4,40.72
+3V3  (via drill 0.35)
  Top 0.254: U2.8 36.63,26.09 35.86,25.32 SJ2.1 | U2.13 39.76,27.35 40.95,28.54 R15.2 | LPS25H.6 10.02,29.43 10.62,30.03 LPS25H.1
  Top 0.35: LPS25H.1 10.62,31.21 | 10.62,31.21 v10.62,33.83 10.62,34.32 10.31,34.63 C1.2 | LPS25H.10 11.69,30.29 11.83,30.43 v11.83,31.21 10.62,31.21 | LPS25H.6 10.02,28.4 9.72,28.1 9.19,28.1 9.01,27.92 C2.2 | STEMMA_I2C.2 51.67,17.02 52.77,17.02 55.87,20.12 R3.2
  Top 0.406: R39.2 41.34,55.88 41.34,56.94 40.87,57.41 37.49,57.41 J3.2 | J7.4 v50.69,43.86 51.3,43.86 51.84,43.32 51.84,37.66 50.97,36.78 R14.2 50.97,33.85 | 50.97,33.85 50.93,33.82 C18.2 49.46,34.01 48.5,34.01 | 50.97,33.85 50.97,30.82 C19.2 50.4,24.73 50.69,24.44 55.42,24.44 55.87,23.99 R25.2 | IC4.8 48.1,33.24 48.5,33.64 48.5,34.01 | 48.5,34.01 48.5,34.43 48.09,34.84 IC4.6 46.75,34.84 45.95,34.04 IC4.2 | IC5.8 7.9,14.62 7.79,14.51 5.14,14.51 4.85,14.8 4.85,16.99 3.96,17.88 C20.2 3.66,19.22 2.14,20.74 2.14,32.22 J4.9 | C2.2 9.01,25.86 9.37,25.5 10.62,25.5 14.13,21.99 18.54,21.99 19.7,20.83 R19.2 | C31.1 35.86,22.39 v35.86,23.37 SJ2.1
  Top 0.508: C7.1 35.61,36.15 35.22,35.76 35.22,32.4 35.58,32.04 R1.2 | R3.2 R25.2
  Top 0.61: C7.1 v37.68,36.15 C8.1 v39.79,36.15 R32.2 | C15.1 8.3,38.64 5.13,38.64 4.59,39.18 R10.2 | R15.2 v41.13,29.4 R16.2 | C31.1 C32.1 35.96,20.14 35.96,18.98 35.96,18.67 | R33.2 R36.1 36.27,18.2 35.96,18.51 35.96,18.67 | R17.2 32.21,11.24 R18.2 30.08,12.79 35.96,18.67 | J2.12 C17.1 16.52,6.27 14.87,7.92 ESP32_LED.1
  Top 0.813: v18.25,41.99 IC2.2 10.87,41.99 9.62,40.74 C15.1
  Top 1.016: J2.11 J2.12
  pour Route2: -5,65 65,65 65,-5 -5,-5
BAT_ALERT  (via drill 0.35)
  Top 0.813: IC2.15 16.02,24.48 15.65,24.12 v14.92,24.12
  Top 1.016: J3.3 J3.4
  Route2 0.254: J3.3 34.84,52.7 34.84,42.65 32.29,40.1 26.28,40.1 23.99,37.81 23.99,30.11 20.62,26.74 19.39,26.74 17.48,28.65 15.61,28.65 14.66,27.7 14.66,24.38 v14.92,24.12
BOOT0
  Top 0.61: SW1.B SW1.B' 33.68,22.14 33.68,26.36 33.29,26.75 IC2.27
D+  (via drill 0.35)
  Top 0.508: IC2.14 13.06,26.75 v12.54,26.23
  Top 1.016: J2.5 J2.6
  Route2 0.508: v12.54,26.23 12.54,19.59 12.97,19.16 12.97,16.4 21.21,8.16 21.21,3.51 22.84,1.88 29.67,1.88 31.27,3.48 J2.5
D-  (via drill 0.35)
  Top 0.813: IC2.13 v16.25,28.02
  Top 1.016: J2.7 J2.8
  Route2 0.508: v16.25,28.02 16.25,18.75 J2.8
ESP32_LED  (via drill 0.35)
  Top 0.508: ESP32_LED.4 14.87,15.43 v15.4,15.96
  Top 0.61: IC2.39 v29.64,41.99
  Route15 0.61: v15.4,15.96 15.4,17.66 31.36,33.62 31.36,40.7 30.07,41.99 v29.64,41.99
ESP_ON  (via drill 0.35)
  Top 0.406: R9.2 v15.27,53.45
  Top 0.813: IC2.9 v16.25,33.1
  Route2 0.406: v15.27,53.45 12.55,53.45 8.76,49.66 8.76,40.59 v16.25,33.1
GND  (via drill 0.35)
  Top 0.254: U2.18 39.48,29.35 39.74,29.61 v39.74,30.77
  Top 0.35: LPS25H.3 7.55,30.29 7.26,30 5,30 J4.7 5,32.54 8.9,32.54 9.16,32.8 C1.1 | LPS25H.9 11.72,29.69 v11.72,29.41 11.72,29.09 | LPS25H.8 11.72,29.09 | C2.1 11.49,27.1 11.72,27.33 v11.72,27.68 11.72,29.09
  Top 0.406: C9.2 R35.1 | J7.6 v50.69,41.66 | ESP32_ON.C 20.84,53.25 21.04,53.45 21.04,55.48 21.83,56.27 J3.12 | C18.1 48.73,32.12 | C19.1 v48.7,31.31 48.7,32.09 48.73,32.12 | IC4.7 47.17,34.04 46.59,33.46 46.59,32.47 46.94,32.12 48.73,32.12 | 7.28,17.06 7.28,15.78 IC5.7 | SW2.A 10.3,17.67 9.69,17.06 7.28,17.06 | 6.61,17.06 6.6,17.05 IC5.6 | IC5.5 5.95,17.06 | 5.95,17.06 6.61,17.06 | C20.1 3.96,21.05 4.65,21.74 5.66,21.74 5.95,21.45 IC5.4 5.95,17.06 | T3.E1 35.74,11.59 35.99,11.34 35.99,9.95 36.25,9.69 37.57,9.69 | UART-EXTRA.4 49.29,14.32 49.29,16.62 49.64,16.97 50.35,16.97 STEMMA_I2C.1 | C8.2 41.73,34.45 42.94,33.24 IC4.1 | SJ2.3 37.66,24.51 v37.66,23.34 C31.2 39.3,22.28 39.97,22.95 C30.2 | 6.61,17.06 7.28,17.06
  Top 0.508: T3.E2 37.57,9.69 v38.71,9.69 | ESP32_LED.3 18.27,11.84 17.61,11.18 14.54,11.18 13.33,9.97 13.33,7.73 16.48,4.57 C17.2
  Top 0.61: J7.9 v35.75,48.95 | C7.2 v37.66,34.45 C8.2 | R24.1 C30.2 | C32.2 C31.2 | SW1.A SW1.A' v33.85,18.85 | STEMMA_I2C.1 50.94,16.38 50.94,16.36 53.55,13.75 STEMMA_I2C.MT1 53.84,13.71 56.31,18.07 56.31,18.27 STEMMA_I2C.MT2 | ESP32_LED.3 18.27,15.79 16.28,17.78 C21.2 16.19,18.89 SW2.A' | C19.1 v48.7,28.97
  Top 0.813: IC2.40 v25.65,43.26 | v16.35,43.26 IC2.1 12.78,43.26 10.68,45.36 C15.2 6.39,45.36 4.62,43.59 C13.2 | IC2.41_7 IC2.41_8 | IC2.41_8 IC2.41_9 IC2.41_3 | IC2.41_1 IC2.41_3 | IC2.41_2 IC2.41_1 | IC2.41_5 IC2.41_4 IC2.41_2 | IC2.41_5 IC2.41_6 | IC2.41_6 IC2.41_3 | IC2.41_5 IC2.41_1 | IC2.41_7 IC2.41_2 | IC2.41_8 IC2.41_1 | IC2.41_7 v20.1,38.44 | IC2.41_6 v22.9,32.64 | R35.1 v43.15,55.7 | SW2.A v12.31,18.89 SW2.A'
  pour Route15: -3,63 63,63 63,-3 -3,-3
GPS_I2C_ENABLE  (via drill 0.35)
  Top 0.406: IC2.6 12.45,36.91 11.59,36.05 8.51,36.05 J4.10
  Top 0.813: IC2.6 v16.25,36.91
  Bottom 0.35: 54.56,30 52.88,30
  Bottom 0.406: v16.25,36.91 16.29,36.91 20.73,41.35 33.72,41.35 42.44,32.63 50.25,32.63 52.88,30 | 54.56,30 55.83,28.73 J1.5
GPS_RX
  Top 0.406: IC2.4 12.66,39.45 11.06,37.85 5.23,37.85 J4.11
GPS_TX
  Top 0.406: IC2.5 12.5,38.18 11.33,37.01 6.93,37.01 J4.12
LORA_GPIO1  (via drill 0.35)
  Top 0.61: IC2.22 24.91,24.48 v24.54,24.12
  Bottom 0.406: v24.54,24.12 25.8,25.38 52.92,25.38 J1.8
LORA_GPIO2  (via drill 0.35)
  Top 0.813: v23.63,28.57 IC2.21
  Bottom 0.406: v23.63,28.57 33.54,28.57 33.6,28.63 34.1,28.63 34.16,28.57 42.84,28.57 44.07,27.34 51.79,27.34 53.18,28.73 J1.6
MCP9808_ALERT  (via drill 0.35)
  Top 0.406: IC5.3 6.6,18.76 6.91,18.45 8.51,18.45 8.93,18.87 v8.93,20.33
  Top 0.813: IC2.38 v29.65,40.72
  Route15 0.406: v8.93,20.33 12.72,20.33 27.96,35.57 27.96,39.86 28.82,40.72 v29.65,40.72
MICROSD_SH2  (via drill 0.35)
  Top 0.305: J7.P3 39.18,51.26 39.7,50.73 42.27,50.73 42.57,51.04 J7.P1 | J7.P4 36.43,38.3 36.94,37.78 45.59,37.78 J7.P2
  Top 0.406: R35.2 46.11,53.65 46.67,53.09 v46.67,52.61 J7.P1 | J7.P2 v46.19,37.23
  Bottom 0.406: v46.67,52.61 46.67,37.72 v46.19,37.23
MPU9250_INT  (via drill 0.35)
  Top 0.254: U2.12 38.23,26.44 38.34,26.33 39.07,26.33 v39.28,26.54
  Top 0.813: IC2.16 v17.29,27.5
  Bottom 0.406: v17.29,27.5 19.16,27.5 20.12,26.54 v39.28,26.54
N$2
  Top 0.406: IC4.5 R14.1
N$3
  Top 0.254: U2.22 37.03,30.46 37.91,31.34 R1.1
N$4
  Top 0.254: U2.11 37.83,26.04 37.92,25.95 40.98,25.95 R24.2
N$6
  Top 0.406: R9.1 19.1,55.15 ESP32_ON.A
N$7
  Top 0.254: U2.9 37.03,25.89 36.75,25.61 SJ2.2
N$17
  Top 0.305: LED2.3 40.94,10.14 39.22,8.42 34.1,8.42 33.87,8.65 33.87,9.59 33.97,9.69
  Top 0.508: 33.97,9.69 T3.C2
N$18
  Top 0.305: 39.43,11.59 LED2.1
  Top 0.508: T3.C1 39.43,11.59
N$22
  Top 0.61: LED2.2 39.17,15.05 R36.2
N$23
  Top 0.61: LED2.4 41.32,15.07 R33.1
REGOUT
  Top 0.254: U2.10 37.43,25.9 37.77,25.56 39.46,25.56 39.97,25.05 C30.1
RX  (via drill 0.35)
  Top 0.508: T3.B1 33.97,10.64 33.66,10.95 v33.66,12.87
  Top 0.813: IC2.36 v29.65,38.18
  Route2 0.406: 42.12,8.25 37.5,12.87 v33.66,12.87 30.27,16.26 30.27,37.56 v29.65,38.18
  Route2 0.508: UART-EXTRA.2 42.12,8.25
RX_RN2483  (via drill 0.35)
  Top 0.813: IC2.10 v16.25,31.83
  Bottom 0.406: J4.5 5,30 7.12,30 8.95,31.83 v16.25,31.83 16.91,31.83 21.08,27.66 21.4,27.34 35.09,27.34 35.4,27.65 42.82,27.65 43.75,26.72 52.21,26.72 52.95,27.46 56.8,27.46 57.54,28.2 57.54,29.25 56.79,30 55.75,30 55,30.75 55,32.81 54,33.81 J1.2
SCL1  (via drill 0.35)
  Top 0.254: U2.23 36.63,30.98 36.64,31 36.64,31.03 v36.66,31.05
  Top 0.35: LPS25H.2 10.02,31.07 9.81,31.28 J4.8
  Top 0.406: IC4.4 44.41,35.64 v44.05,36
  Top 0.813: IC2.7 v16.25,35.64 | R15.1 v42.65,26.84
  Top 1.016: J3.5 J3.6
  Route2 0.508: v44.05,36 42.9,36 37.95,31.05 v36.66,31.05
  Route15 0.406: J4.8 10.64,35.64 v16.25,35.64
  Route15 0.61: v42.65,26.84 42.21,26.84 38,31.05 v36.66,31.05
  Bottom 0.406: J3.6 32.63,57.63 37.43,57.63 44.79,50.27 44.79,36.74 v44.05,36 56.57,36 58.03,34.54 58.03,32.43 56.87,31.27 J1.3 | v16.25,35.64 17.08,35.64 18.09,34.63 18.09,33.19 20.07,31.21 36.41,31.21 36.57,31.05 v36.66,31.05
SCL2  (via drill 0.35)
  Top 0.406: IC5.2 7.25,21.4 6.34,22.31 5.01,22.31 3.73,23.59 J4.1
  Top 0.61: STEMMA_I2C.4 53.69,19.11 54.17,19.59 R3.1 v52.65,21.18
  Top 0.813: IC2.25 v28.71,22 | R18.1 v28.32,9.54
  Route2 0.406: J2.3 32.54,5 32.54,7.12 31.86,7.8 30.06,7.8 v28.32,9.54
  Route15 0.61: v52.65,21.18 29.53,21.18 v28.71,22
  Bottom 0.61: v28.71,22 5.38,22 J4.1
  Bottom 0.813: v28.32,9.54 28.72,9.94 28.72,21.35 28.71,21.35 v28.71,22
SD_DETECT
  Top 0.305: J7.10 34.05,44.68 33.36,45.38 33.36,51.83 33.76,52.24 39.16,52.24 39.65,52.73 C9.1
  Top 0.406: R39.1 C9.1 | IC2.34 32.93,35.64 33.17,35.88 33.17,38.94 34.14,39.91 J7.10
SDA1  (via drill 0.35, 0.35 pad 0.55)
  Top 0.254: U2.24 36.23,30.44 v36.05,30.56
  Top 0.35: LPS25H.4 7.99,29.69 7.03,28.73 J4.6
  Top 0.406: IC4.3 43.8,34.84 v43.44,34.48
  Top 0.813: IC2.8 v16.25,34.37 | R16.1 v42.64,31.96
  Top 1.016: J3.7 J3.8
  Route2 0.61: v42.64,31.96 42.64,32.83 43.44,33.63 v43.44,34.48
  Route15 0.406: J4.6 6.38,28.73 12.02,34.37 v16.25,34.37 | v43.44,34.48 50.74,34.48 51.84,35.58 54.5,35.58 J1.1
  Route15 0.61: v42.64,31.96 36.15,31.93 35.74,31.52 35.74,30.94 v36.05,30.56
  Bottom 0.406: v43.44,34.48 43.01,34.91 43.01,48.91 39.83,52.09 30.37,52.09 J3.7 | v16.25,34.37 16.92,34.37 17.49,33.8 17.49,32.9 20.47,29.92 35.35,29.92 v36.05,30.56
SDA2  (via drill 0.35)
  Top 0.406: IC5.1 7.9,22.02 J4.2 | J2.4 33.81,6.71 34.87,7.77 39.4,7.77 50.53,18.9 50.96,18.9
  Top 0.61: STEMMA_I2C.3 51.66,18.4 51.46,18.4 50.96,18.9 50.11,19.75 50.11,20.6 52.76,23.25 R25.1 | J2.4 33.81,6.84 32.23,8.42 R17.1
  Top 0.813: IC2.24 v27.45,23.5
  Bottom 0.508: J2.4 32.23,7.85 32.23,22.98 31.7,23.51 27.45,23.51
  Bottom 0.61: v27.45,23.5 27.22,23.27 26.74,22.79 7.13,22.79 J4.2
  Bottom 0.813: 27.45,23.51 27.22,23.27
SIPM  (via drill 0.35)
  Top 0.35: IC2.17 18.55,23.65 19.57,22.63 22.17,22.63 27.43,17.37 27.43,4.97 J2.9
  Top 0.813: IC2.17 v18.55,28.77
  Route2 0.254: J3.9 27.72,52.2 33.22,52.2 33.76,51.66 33.76,43.65 31.46,41.35 21.58,41.35 17.82,37.59 17.82,29.5 v18.55,28.77
SPI_CS  (via drill 0.35)
  Top 0.305: v33.85,34.37 34.36,34.88 34.36,36.57 34.99,37.2 42.26,37.2 42.49,36.97 R32.1
  Top 0.406: J7.2 v49.09,46.06
  Top 0.813: IC2.33 v33.85,34.37
  Route2 0.406: v33.85,34.37 33.85,35.17 46.99,48.31 49.7,48.31 50.23,47.78 50.23,46.56 49.73,46.06 v49.09,46.06
SPI_DATA1  (via drill 0.35)
  Top 0.406: J7.8 v49.09,39.46
  Top 0.813: v33.85,31.83 IC2.31
  Route15 0.406: v33.85,31.83 35.1,33.08 35.1,35.59 36.4,36.89 44.36,36.89 46.93,39.46 v49.09,39.46
SPI_DATA2  (via drill 0.35)
  Top 0.406: J7.1 v49.09,47.16
  Top 0.813: IC2.32 v33.85,33.1
  Route2 0.406: v33.85,33.1 36.61,35.86 36.61,36.6 47.17,47.16 v49.09,47.16
SPI_MISO  (via drill 0.35)
  Top 0.406: J7.7 v49.09,40.56
  Top 0.813: IC2.30 v33.85,30.56
  Route15 0.406: v49.09,40.56 49.65,40.56 50.63,39.58 50.63,38.32 47.67,35.36 36.88,35.36 36.1,34.58 36.1,32.79 33.87,30.56 v33.85,30.56
SPI_MOSI  (via drill 0.35)
  Top 0.406: J7.3 v49.09,44.96
  Top 0.813: IC2.28 v33.85,28.02
  Route2 0.406: v49.09,44.96 47.77,43.64 47.77,28.8 46.56,27.59 34.28,27.59 v33.85,28.02
SPI_SCK  (via drill 0.35)
  Top 0.406: J7.5 v49.09,42.76
  Top 0.813: IC2.29 v33.85,29.29
  Route15 0.406: v33.85,29.29 32.66,30.48 32.66,35.49 39.93,42.76 v49.09,42.76
TOP_LED  (via drill 0.35)
  Top 0.813: IC2.18 v19.82,23.5
  Bottom 0.305: v19.82,23.5 25.19,23.5 26.04,24.35 54.7,24.35 56.27,25.92 J1.7
  Bottom 0.406: v19.82,23.5 8.96,23.5 J4.4
TX  (via drill 0.35)
  Top 0.508: T3.B2 v38.23,10.64
  Top 0.813: IC2.37 v29.65,39.45
  Route2 0.406: 38.25,10.66 38.82,10.66 40.8,8.67 UART-EXTRA.1 | v29.65,39.45 29.21,39.01 26.54,39.01 25.46,37.93 25.46,18.44 33.26,10.64 v38.23,10.64
  Route2 0.508: v38.23,10.64 38.25,10.66
TX_RN2483  (via drill 0.35)
  Top 0.813: IC2.11 v16.25,30.56
  Route15 0.508: v16.25,30.56 22.05,30.56 27.38,35.88 27.38,42.38 27.75,42.76 38.57,42.76 39.46,43.64 49.83,43.64 57.93,35.54 57.93,25.33 57.14,24.54 53.07,24.54 52.12,25.49 52.12,29.66 J1.4
  Bottom 0.406: v16.25,30.56 16.25,30.24 13.04,27.03 7.22,27.03 6.8,27.46 5.7,27.46 4.43,26.19 J4.3